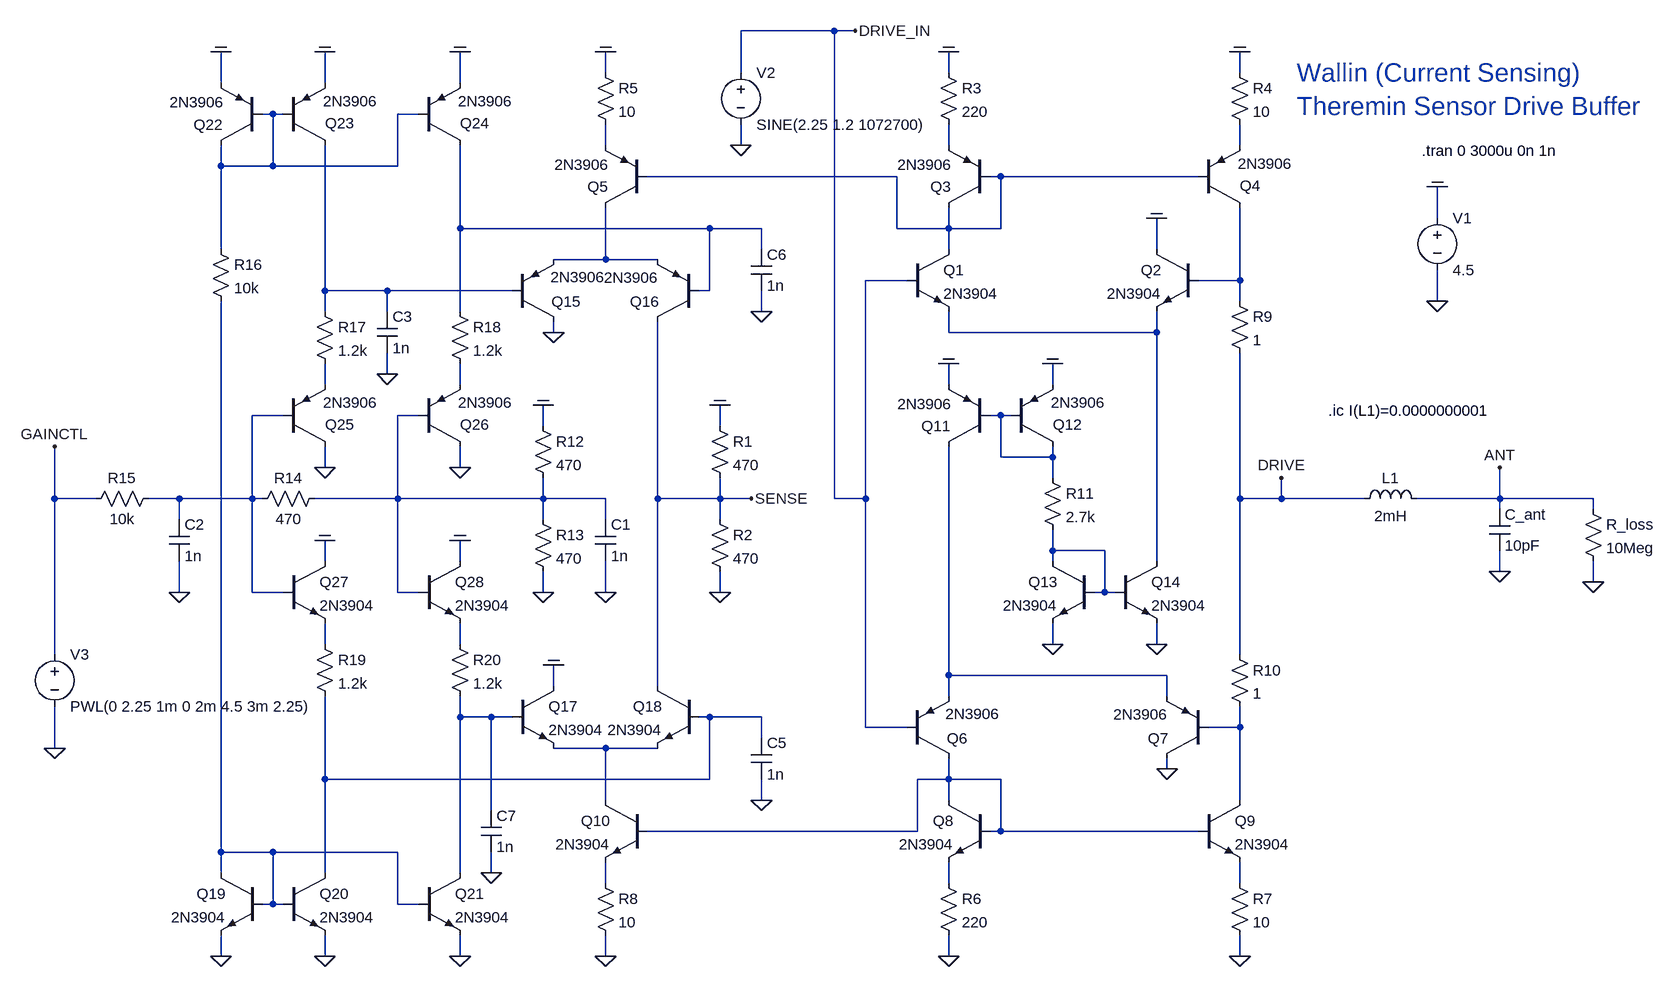
[diagram p0: schematic current_sensing_drive_buffer_v03.asc]
current_sensing_drive_buffer_v03.asc, the LTspice schematic file:
Version 4
SHEET 1 4504 6144
WIRE 1088 2224 944 2224
WIRE 1120 2224 1088 2224
WIRE 736 2288 736 2256
WIRE 944 2288 944 2224
WIRE 1264 2288 1264 2256
WIRE 1712 2288 1712 2256
WIRE 144 2304 144 2256
WIRE 304 2304 304 2256
WIRE 512 2304 512 2256
WIRE 224 2352 208 2352
WIRE 240 2352 224 2352
WIRE 448 2352 416 2352
WIRE 736 2400 736 2368
WIRE 944 2400 944 2368
WIRE 1264 2400 1264 2368
WIRE 1712 2400 1712 2368
WIRE 144 2432 144 2400
WIRE 224 2432 224 2352
WIRE 224 2432 144 2432
WIRE 416 2432 416 2352
WIRE 416 2432 224 2432
WIRE 1184 2448 800 2448
WIRE 1344 2448 1328 2448
WIRE 1648 2448 1344 2448
WIRE 2016 2512 2016 2464
WIRE 512 2528 512 2400
WIRE 896 2528 512 2528
WIRE 976 2528 896 2528
WIRE 1184 2528 1184 2448
WIRE 1264 2528 1264 2496
WIRE 1264 2528 1184 2528
WIRE 1344 2528 1344 2448
WIRE 1344 2528 1264 2528
WIRE 144 2560 144 2432
WIRE 976 2560 976 2528
WIRE 1264 2560 1264 2528
WIRE 1584 2560 1584 2512
WIRE 736 2576 736 2496
WIRE 736 2576 656 2576
WIRE 816 2576 736 2576
WIRE 1200 2608 1136 2608
WIRE 1712 2608 1712 2496
WIRE 1712 2608 1648 2608
WIRE 304 2624 304 2400
WIRE 400 2624 304 2624
WIRE 592 2624 400 2624
WIRE 896 2624 896 2528
WIRE 896 2624 880 2624
WIRE 1712 2640 1712 2608
WIRE 2016 2640 2016 2592
WIRE 304 2656 304 2624
WIRE 400 2656 400 2624
WIRE 512 2656 512 2528
WIRE 976 2656 976 2624
WIRE 656 2688 656 2672
WIRE 1264 2688 1264 2656
WIRE 1584 2688 1584 2656
WIRE 1584 2688 1264 2688
WIRE 400 2752 400 2720
WIRE 304 2768 304 2736
WIRE 512 2768 512 2736
WIRE 1264 2768 1264 2736
WIRE 1424 2768 1424 2736
WIRE 240 2816 192 2816
WIRE 448 2816 416 2816
WIRE 1344 2816 1328 2816
WIRE 1360 2816 1344 2816
WIRE 640 2832 640 2800
WIRE 912 2832 912 2800
WIRE 1344 2880 1344 2816
WIRE 1424 2880 1424 2864
WIRE 1424 2880 1344 2880
WIRE 304 2896 304 2864
WIRE 512 2896 512 2864
WIRE 1424 2912 1424 2880
WIRE -112 2944 -112 2864
WIRE -48 2944 -112 2944
WIRE 80 2944 32 2944
WIRE 192 2944 192 2816
WIRE 192 2944 80 2944
WIRE 208 2944 192 2944
WIRE 416 2944 416 2816
WIRE 416 2944 288 2944
WIRE 640 2944 640 2912
WIRE 640 2944 416 2944
WIRE 736 2944 640 2944
WIRE 816 2944 816 2672
WIRE 912 2944 912 2912
WIRE 912 2944 816 2944
WIRE 960 2944 912 2944
WIRE 1088 2944 1088 2224
WIRE 1136 2944 1136 2608
WIRE 1136 2944 1088 2944
WIRE 1712 2944 1712 2720
WIRE 1776 2944 1776 2912
WIRE 1776 2944 1712 2944
WIRE 1904 2944 1776 2944
WIRE 2112 2944 2112 2896
WIRE 2112 2944 1984 2944
WIRE 2256 2944 2112 2944
WIRE 2112 2960 2112 2944
WIRE 2256 2960 2256 2944
WIRE 80 2976 80 2944
WIRE 640 2976 640 2944
WIRE 736 2976 736 2944
WIRE 912 2976 912 2944
WIRE 1424 3024 1424 2992
WIRE 1504 3024 1424 3024
WIRE 304 3040 304 3008
WIRE 512 3040 512 3008
WIRE 1424 3040 1424 3024
WIRE 1584 3040 1584 2688
WIRE 2112 3056 2112 3024
WIRE 2256 3072 2256 3040
WIRE 80 3088 80 3040
WIRE 192 3088 192 2944
WIRE 240 3088 192 3088
WIRE 416 3088 416 2944
WIRE 448 3088 416 3088
WIRE 640 3088 640 3056
WIRE 736 3088 736 3040
WIRE 912 3088 912 3056
WIRE 1504 3088 1504 3024
WIRE 1504 3088 1488 3088
WIRE 1520 3088 1504 3088
WIRE 304 3168 304 3136
WIRE 512 3168 512 3136
WIRE 1424 3168 1424 3136
WIRE 1584 3168 1584 3136
WIRE -112 3184 -112 2944
WIRE 1712 3184 1712 2944
WIRE 1264 3216 1264 2864
WIRE 1600 3216 1264 3216
WIRE 656 3232 656 3200
WIRE 816 3232 816 2944
WIRE 1264 3248 1264 3216
WIRE 1600 3248 1600 3216
WIRE 512 3280 512 3248
WIRE 560 3280 512 3280
WIRE 592 3280 560 3280
WIRE 896 3280 880 3280
WIRE 976 3280 896 3280
WIRE 1136 3296 1136 2944
WIRE 1200 3296 1136 3296
WIRE 1712 3296 1712 3264
WIRE 1712 3296 1664 3296
WIRE 976 3312 976 3280
WIRE -112 3328 -112 3264
WIRE 736 3328 656 3328
WIRE 816 3328 736 3328
WIRE 1600 3360 1600 3344
WIRE 304 3376 304 3248
WIRE 896 3376 896 3280
WIRE 896 3376 304 3376
WIRE 1264 3376 1264 3344
WIRE 1264 3376 1216 3376
WIRE 1344 3376 1264 3376
WIRE 736 3408 736 3328
WIRE 976 3408 976 3376
WIRE 1264 3408 1264 3376
WIRE 1712 3408 1712 3296
WIRE 560 3424 560 3280
WIRE 1216 3456 1216 3376
WIRE 1216 3456 800 3456
WIRE 1344 3456 1344 3376
WIRE 1344 3456 1328 3456
WIRE 1648 3456 1344 3456
WIRE 144 3488 144 2640
WIRE 224 3488 144 3488
WIRE 416 3488 224 3488
WIRE 144 3520 144 3488
WIRE 304 3520 304 3376
WIRE 512 3520 512 3280
WIRE 560 3520 560 3488
WIRE 736 3536 736 3504
WIRE 1264 3536 1264 3504
WIRE 1712 3536 1712 3504
WIRE 224 3568 224 3488
WIRE 224 3568 208 3568
WIRE 240 3568 224 3568
WIRE 416 3568 416 3488
WIRE 448 3568 416 3568
WIRE 144 3648 144 3616
WIRE 304 3648 304 3616
WIRE 512 3648 512 3616
WIRE 736 3648 736 3616
WIRE 1264 3648 1264 3616
WIRE 1712 3648 1712 3616
FLAG 2016 2640 0
FLAG 2016 2464 COM
FLAG 1424 3168 0
FLAG 1584 3168 0
FLAG 1264 2256 COM
FLAG 1712 2256 COM
FLAG 1584 2512 COM
FLAG 944 2400 0
FLAG 1424 2736 COM
FLAG 1264 2736 COM
FLAG 1264 3648 0
FLAG 1712 3648 0
FLAG 1600 3360 0
FLAG 736 2256 COM
FLAG 736 3648 0
FLAG 2112 3056 0
FLAG 2112 2896 ANT
FLAG 1776 2912 DRIVE
FLAG 2256 3072 0
FLAG 912 3088 0
FLAG 912 2800 COM
FLAG 960 2944 SENSE
FLAG 1120 2224 DRIVE_IN
FLAG 144 3648 0
FLAG 304 3648 0
FLAG 144 2256 COM
FLAG 304 2256 COM
FLAG 512 3648 0
FLAG 512 2256 COM
FLAG 512 2896 0
FLAG 304 2896 0
FLAG 304 3008 COM
FLAG 512 3008 COM
FLAG 640 3088 0
FLAG 640 2800 COM
FLAG 736 3088 0
FLAG 80 3088 0
FLAG 656 2688 0
FLAG 656 3200 COM
FLAG -112 3328 0
FLAG -112 2864 GAINCTL
FLAG 976 3408 0
FLAG 976 2656 0
FLAG 560 3520 0
FLAG 400 2752 0
SYMBOL voltage 2016 2496 R0
SYMATTR InstName V1
SYMATTR Value 4.5
SYMBOL npn 1488 3040 M0
SYMATTR InstName Q13
SYMATTR Value 2N3904
SYMBOL npn 1520 3040 R0
SYMATTR InstName Q14
SYMATTR Value 2N3904
SYMBOL npn 1648 2560 M0
SYMATTR InstName Q2
SYMATTR Value 2N3904
SYMBOL npn 1200 2560 R0
SYMATTR InstName Q1
SYMATTR Value 2N3904
SYMBOL pnp 1328 2496 R180
WINDOW 0 60 32 Left 2
WINDOW 3 58 66 Left 2
SYMATTR InstName Q3
SYMATTR Value 2N3906
SYMBOL Res 1248 2272 R0
SYMATTR InstName R3
SYMATTR Value 220
SYMBOL pnp 1648 2496 M180
WINDOW 0 64 34 Left 2
WINDOW 3 61 68 Left 2
SYMATTR InstName Q4
SYMATTR Value 2N3906
SYMBOL Res 1696 2272 R0
SYMATTR InstName R4
SYMATTR Value 10
SYMBOL Voltage 944 2272 R0
SYMATTR InstName V2
SYMATTR Value SINE(2.25 1.2 1072700)
SYMBOL pnp 1328 2864 R180
WINDOW 0 60 32 Left 2
WINDOW 3 58 66 Left 2
SYMATTR InstName Q11
SYMATTR Value 2N3906
SYMBOL pnp 1360 2864 M180
WINDOW 0 64 34 Left 2
WINDOW 3 61 68 Left 2
SYMATTR InstName Q12
SYMATTR Value 2N3906
SYMBOL npn 1328 3408 M0
SYMATTR InstName Q8
SYMATTR Value 2N3904
SYMBOL npn 1648 3408 R0
SYMATTR InstName Q9
SYMATTR Value 2N3904
SYMBOL Res 1248 3520 R0
SYMATTR InstName R6
SYMATTR Value 220
SYMBOL Res 1696 3520 R0
SYMATTR InstName R7
SYMATTR Value 10
SYMBOL pnp 1664 3344 R180
WINDOW 0 61 31 Left 2
WINDOW 3 62 68 Left 2
SYMATTR InstName Q7
SYMATTR Value 2N3906
SYMBOL pnp 1200 3344 M180
WINDOW 0 61 31 Left 2
WINDOW 3 59 69 Left 2
SYMATTR InstName Q6
SYMATTR Value 2N3906
SYMBOL Res 1696 3168 R0
SYMATTR InstName R10
SYMATTR Value 1
SYMBOL Res 1696 2624 R0
SYMATTR InstName R9
SYMATTR Value 1
SYMBOL pnp 800 2496 R180
WINDOW 0 60 32 Left 2
WINDOW 3 58 66 Left 2
SYMATTR InstName Q5
SYMATTR Value 2N3906
SYMBOL Res 720 2272 R0
SYMATTR InstName R5
SYMATTR Value 10
SYMBOL npn 800 3408 M0
SYMATTR InstName Q10
SYMATTR Value 2N3904
SYMBOL Res 720 3520 R0
SYMATTR InstName R8
SYMATTR Value 10
SYMBOL ind 1888 2960 R270
WINDOW 0 32 56 VTop 2
WINDOW 3 5 56 VBottom 2
SYMATTR InstName L1
SYMATTR Value 2mH
SYMATTR SpiceLine Rser=120 Cpar=1pF
SYMBOL Cap 2096 2960 R0
SYMATTR InstName C_ant
SYMATTR Value 10pF
SYMBOL Res 2240 2944 R0
SYMATTR InstName R_loss
SYMATTR Value 10Meg
SYMBOL Res 896 2960 R0
SYMATTR InstName R2
SYMATTR Value 470
SYMBOL Res 896 2816 R0
SYMATTR InstName R1
SYMATTR Value 470
SYMBOL Res 1408 2896 R0
SYMATTR InstName R11
SYMATTR Value 2.7k
SYMBOL npn 208 3520 M0
SYMATTR InstName Q19
SYMATTR Value 2N3904
SYMBOL npn 240 3520 R0
SYMATTR InstName Q20
SYMATTR Value 2N3904
SYMBOL pnp 208 2400 R180
WINDOW 0 60 32 Left 2
WINDOW 3 58 66 Left 2
SYMATTR InstName Q22
SYMATTR Value 2N3906
SYMBOL pnp 240 2400 M180
WINDOW 0 64 34 Left 2
WINDOW 3 61 68 Left 2
SYMATTR InstName Q23
SYMATTR Value 2N3906
SYMBOL npn 448 3520 R0
SYMATTR InstName Q21
SYMATTR Value 2N3904
SYMBOL pnp 448 2400 M180
WINDOW 0 64 34 Left 2
WINDOW 3 61 68 Left 2
SYMATTR InstName Q24
SYMATTR Value 2N3906
SYMBOL npn 240 3040 R0
SYMATTR InstName Q27
SYMATTR Value 2N3904
SYMBOL pnp 240 2864 M180
WINDOW 0 64 34 Left 2
WINDOW 3 61 68 Left 2
SYMATTR InstName Q25
SYMATTR Value 2N3906
SYMBOL pnp 448 2864 M180
WINDOW 0 64 34 Left 2
WINDOW 3 61 68 Left 2
SYMATTR InstName Q26
SYMATTR Value 2N3906
SYMBOL npn 448 3040 R0
SYMATTR InstName Q28
SYMATTR Value 2N3904
SYMBOL Res 624 2960 R0
SYMATTR InstName R13
SYMATTR Value 470
SYMBOL Res 624 2816 R0
SYMATTR InstName R12
SYMATTR Value 470
SYMBOL Res 304 2928 R90
WINDOW 0 0 56 VBottom 2
WINDOW 3 32 56 VTop 2
SYMATTR InstName R14
SYMATTR Value 470
SYMBOL Res 48 2928 R90
WINDOW 0 0 56 VBottom 2
WINDOW 3 32 56 VTop 2
SYMATTR InstName R15
SYMATTR Value 10k
SYMBOL Cap 720 2976 R0
SYMATTR InstName C1
SYMATTR Value 1n
SYMBOL Cap 64 2976 R0
SYMATTR InstName C2
SYMATTR Value 1n
SYMBOL Res 128 2544 R0
SYMATTR InstName R16
SYMATTR Value 10k
SYMBOL pnp 880 2672 R180
WINDOW 0 61 31 Left 2
WINDOW 3 62 68 Left 2
SYMATTR InstName Q16
SYMATTR Value 2N3906
SYMBOL pnp 592 2672 M180
WINDOW 0 61 31 Left 2
WINDOW 3 59 69 Left 2
SYMATTR InstName Q15
SYMATTR Value 2N3906
SYMBOL npn 880 3232 M0
SYMATTR InstName Q18
SYMATTR Value 2N3904
SYMBOL npn 592 3232 R0
SYMATTR InstName Q17
SYMATTR Value 2N3904
SYMBOL Voltage -112 3168 R0
SYMATTR InstName V3
SYMATTR Value PWL(0 2.25 1m 0 2m 4.5 3m 2.25)
SYMBOL Res 288 2640 R0
SYMATTR InstName R17
SYMATTR Value 1.2k
SYMBOL Res 496 2640 R0
SYMATTR InstName R18
SYMATTR Value 1.2k
SYMBOL Res 288 3152 R0
SYMATTR InstName R19
SYMATTR Value 1.2k
SYMBOL Res 496 3152 R0
SYMATTR InstName R20
SYMATTR Value 1.2k
SYMBOL Cap 960 3312 R0
SYMATTR InstName C5
SYMATTR Value 1n
SYMBOL Cap 960 2560 R0
SYMATTR InstName C6
SYMATTR Value 1n
SYMBOL Cap 544 3424 R0
SYMATTR InstName C7
SYMATTR Value 1n
SYMBOL Cap 384 2656 R0
SYMATTR InstName C3
SYMATTR Value 1n
TEXT 1992 2408 Left 2 !.tran 0 3000u 0n 1n
TEXT 1848 2808 Left 2 !.ic I(L1)=0.0000000001
TEXT 1800 2288 Left 4 ;Wallin (Current Sensing) \nTheremin Sensor Drive Buffer

The netlist it stands for:
* current_sensing_drive_buffer_v03.asc
V1 COM 0 4.5
Q13 N016 N016 0 0 2N3904
Q14 N010 N016 0 0 2N3904
Q2 COM N008 N010 0 2N3904
Q1 N005 DRIVE_IN N010 0 2N3904
Q3 N005 N005 N003 0 2N3906
R3 COM N003 220
Q4 N008 N005 N004 0 2N3906
R4 COM N004 10
V2 DRIVE_IN 0 SINE(2.25 1.2 1072700)
Q11 N019 N015 COM 0 2N3906
Q12 N015 N015 COM 0 2N3906
Q8 N024 N024 N027 0 2N3904
Q9 N022 N024 N028 0 2N3904
R6 N027 0 220
R7 N028 0 10
Q7 0 N022 N019 0 2N3906
Q6 N024 DRIVE_IN N019 0 2N3906
R10 DRIVE N022 1
R9 N008 DRIVE 1
Q5 N007 N005 N002 0 2N3906
R5 COM N002 10
Q10 N023 N024 N026 0 2N3904
R8 N026 0 10
L1 DRIVE ANT 2mH Rser=120 Cpar=1pF
C_ant ANT 0 10pF
R_loss ANT 0 10Meg
R2 SENSE 0 470
R1 COM SENSE 470
R11 N015 N016 2.7k
Q19 N025 N025 0 0 2N3904
Q20 N021 N025 0 0 2N3904
Q22 N001 N001 COM 0 2N3906
Q23 N009 N001 COM 0 2N3906
Q21 N020 N025 0 0 2N3904
Q24 N006 N001 COM 0 2N3906
Q27 COM N013 N017 0 2N3904
Q25 0 N013 N011 0 2N3906
Q26 0 N014 N012 0 2N3906
Q28 COM N014 N018 0 2N3904
R13 N014 0 470
R12 COM N014 470
R14 N014 N013 470
R15 N013 GAINCTL 10k
C1 N014 0 1n
C2 N013 0 1n
R16 N001 N025 10k
Q16 SENSE N006 N007 0 2N3906
Q15 0 N009 N007 0 2N3906
Q18 SENSE N021 N023 0 2N3904
Q17 COM N020 N023 0 2N3904
V3 GAINCTL 0 PWL(0 2.25 1m 0 2m 4.5 3m 2.25)
R17 N009 N011 1.2k
R18 N006 N012 1.2k
R19 N017 N021 1.2k
R20 N018 N020 1.2k
C5 N021 0 1n
C6 N006 0 1n
C7 N020 0 1n
C3 N009 0 1n
.model NPN NPN
.model PNP PNP
.lib standard.bjt
.tran 0 3000u 0n 1n
.ic I(L1)=0.0000000001
* Wallin (Current Sensing)
* Theremin Sensor Drive Buffer
.backanno
.end